# EAGLE schematic HeaterCotrolPlusPIC (EAGLE 7.5.0)
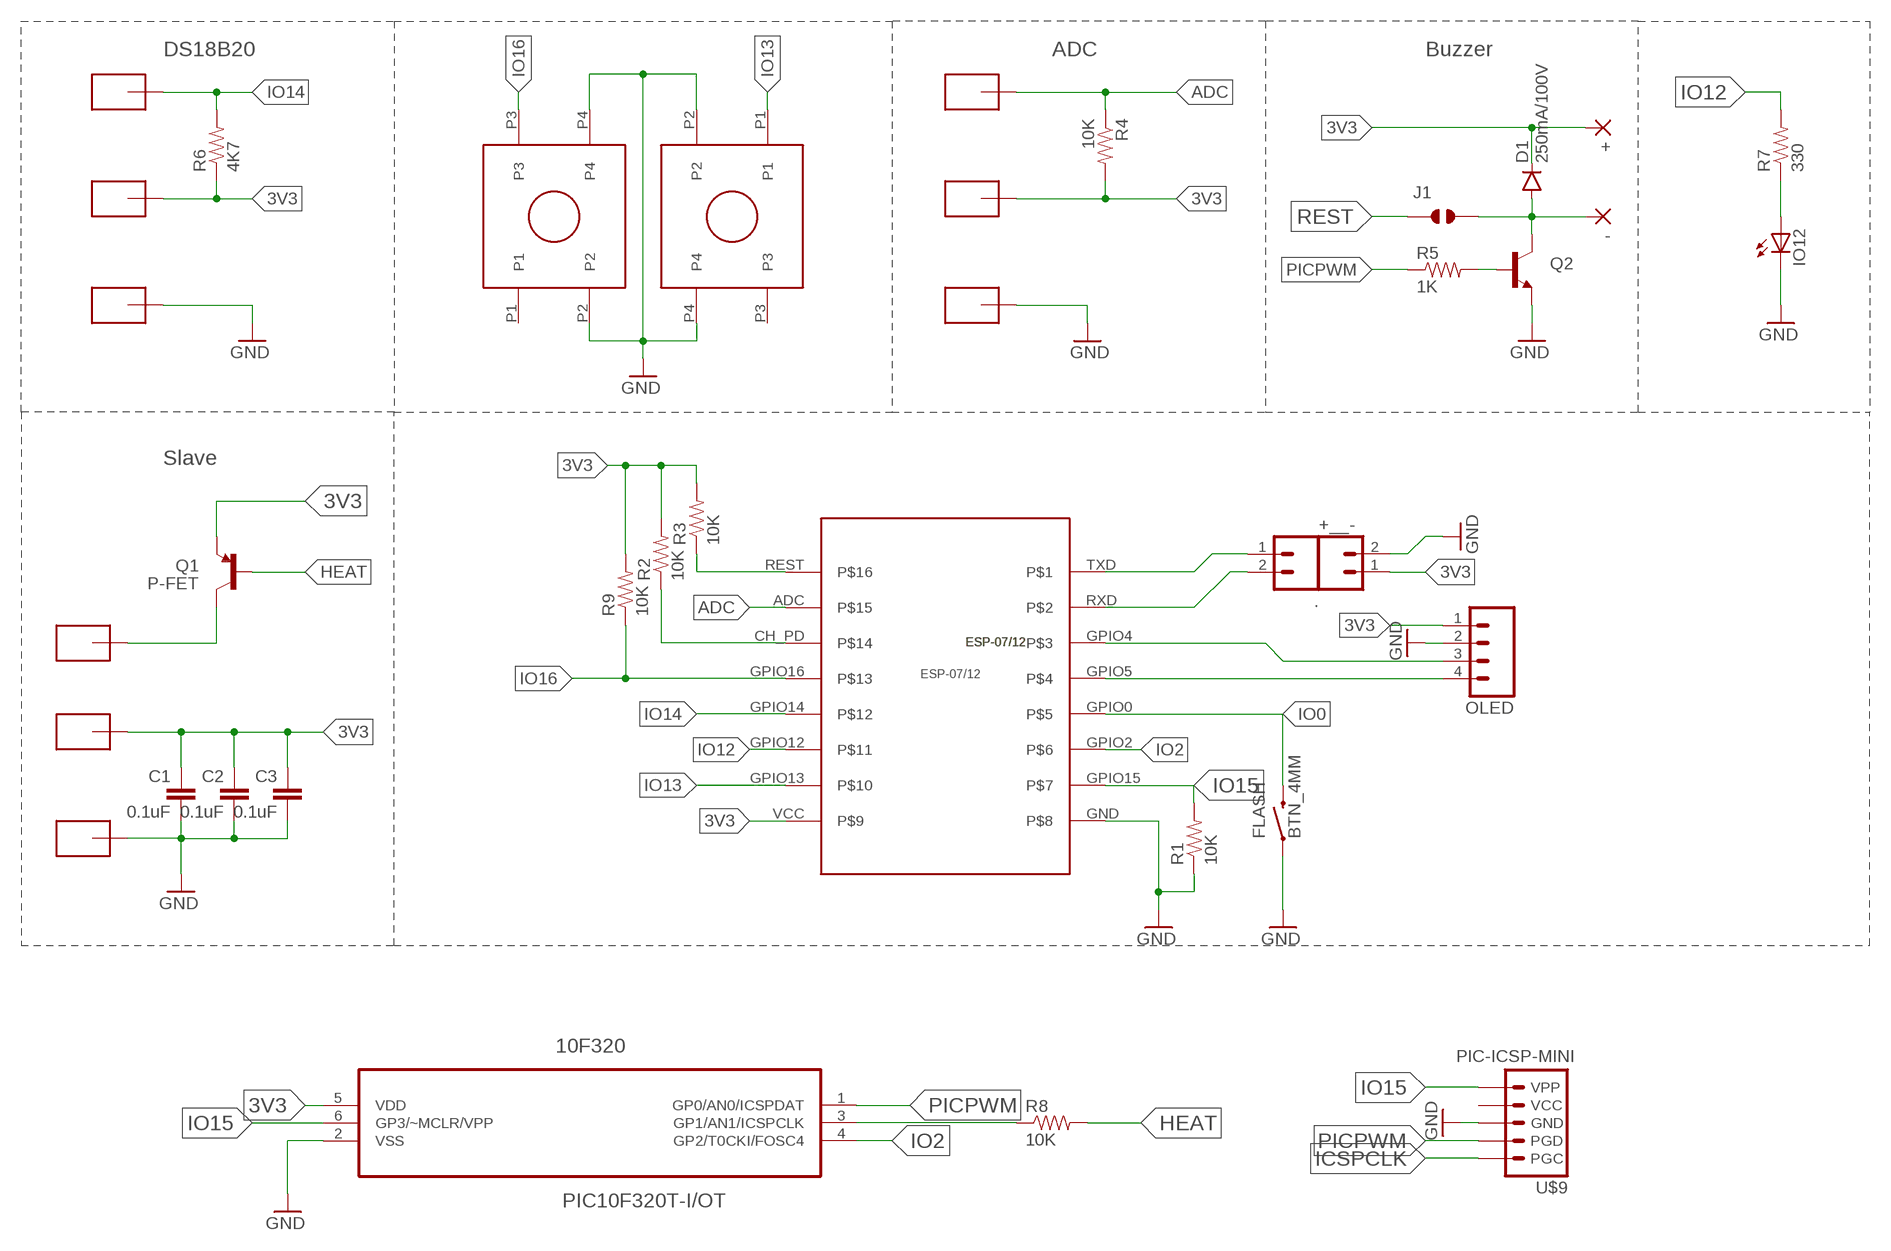
[diagram p0: schematic, sheet 1]

## Parts
10F320  PIC10F320T-I/OT  PIC10F220T-I/OT  [SOT95P270X145-6N]
+  1,6/0,8  [1,6/0,8]
+__-  M02PTH  [1X02]
-  1,6/0,8  [1,6/0,8]
.  M02PTH  [1X02]
C1  0.1uF  CAP  [0805-CAP]
C2  0.1uF  CAP  [0805-CAP]
C3  0.1uF  CAP  [0805-CAP]
D1  250mA/100V  DIODEBAS16  [SOD-323]
FLASH  BTN_4MM  [BTN_4MM]
IO12  LEDCHIP-LED0805  [CHIP-LED0805]
J1  JUMPER_SOLDER_1X2  [JUMPER_SOLDER_1X2]
LEFT  OMROM_TH  [OMROM_TH]
OLED  M04PTH  [1X04]
Q1  P-FET  TRANSISTOR_PNPSMD  [SOT23-3]
Q2  TRANSISTOR_NPNSOT23-3  [SOT23-3]
R1  10K  RESISTOR0805-RES  [0805]
R2  10K  RESISTOR0805-RES  [0805]
R3  10K  RESISTOR0805-RES  [0805]
R4  10K  RESISTOR0805-RES  [0805]
R5  1K  RESISTOR0805-RES  [0805]
R6  4K7  RESISTOR0805-RES  [0805]
R7  330  RESISTOR0805-RES  [0805]
R8  10K  RESISTOR0805-RES  [0805]
R9  10K  RESISTOR0805-RES  [0805]
RIGHT  OMROM_TH  [OMROM_TH]
U$1  ESP-07/12  [ESP-07/12]
U$2  SMD-PAD1  [SMD-PAD1]
U$3  SMD-PAD1  [SMD-PAD1]
U$4  SMD-PAD1  [SMD-PAD1]
U$5  SMD-PAD1  [SMD-PAD1]
U$6  SMD-PAD1  [SMD-PAD1]
U$7  SMD-PAD1  [SMD-PAD1]
U$8  SMD-PAD1  [SMD-PAD1]
U$9  PIC-ICSP-MINI  [PIC-ICSP-MINI]
U$10  SMD-PAD1  [SMD-PAD1]
U$11  SMD-PAD1  [SMD-PAD1]

## Nets
3V3: 10F320.5(VDD) +.1(P) +__-.1 C1.1 C2.1 C3.1 D1.C OLED.1 Q1.2(E) R2.2 R3.2 R4.2 R6.1 R9.2 U$1.VCC U$3.>NAME U$4.>NAME U$8.>NAME
ADC: R4.1 U$1.ADC U$7.>NAME
GND: 10F320.2(VSS) +__-.2 C1.2 C2.2 C3.2 FLASH.1 IO12.C LEFT.P2 LEFT.P4 OLED.2 Q2.2(E) R1.1 RIGHT.P2 RIGHT.P4 U$1.GND U$5.>NAME U$6.>NAME U$9.3(GND) U$11.>NAME
HEAT: Q1.1(B) R8.2
ICSPCLK: 10F320.3(GP1/AN1/ICSPCLK) R8.1 U$9.5(PGC)
IO0: FLASH.2 U$1.GPIO0
IO2: 10F320.4(GP2/T0CKI/FOSC4) U$1.GPIO2
IO12: R7.2 U$1.GPIO12
IO13: RIGHT.P1 U$1.GPIO13
IO14: R6.2 U$1.GPIO14 U$10.>NAME
IO15: 10F320.6(GP3/~MCLR/VPP) R1.2 U$1.GPIO15 U$9.1(VPP)
IO16: LEFT.P3 R9.1 U$1.GPIO16
N$1: Q1.3(C) U$2.>NAME
N$2: Q2.1(B) R5.2
N$3: OLED.3 U$1.GPIO4
N$4: -.1(P) D1.A J1.2 Q2.3(C)
N$5: IO12.A R7.1
N$9: OLED.4 U$1.GPIO5
N$11: R2.1 U$1.CH_PD
PICPWM: 10F320.1(GP0/AN0/ICSPDAT) R5.1 U$9.4(PGD)
REST: J1.1 R3.1 U$1.REST
RXD: ..2 U$1.RXD
TXD: ..1 U$1.TXD
Unconnected: LEFT.P1 RIGHT.P3 U$9.2(VCC)

## Notes on the sheet
- DS18B20 | ADC | Buzzer
- Slave

## Library data of the parts
10F320 = Microchip_By_element14_Batch_1:PIC10F220T-I/OT: High-Performance Microcontroller with 8-bit A/D; MPN: PIC10F220T-I/OT; OC_FARNELL: 1332175; OC_NEWARK: 31K4981; PACKAGE: SOT-6; SUPPLIER: Microchip
+ - = wirepad:1,6/0,8: THROUGH-HOLE PAD
+__- . = SparkFun-Connectors:M02: Standard 2-pin 0.1" header. Use with - straight break away headers ( PRT-00116) - right angle break away headers (PRT-00553) - swiss pins (PRT-00743) - machine pins (PRT-00117) - female headers (PRT-00115) Molex polarized connector foot print use with: PRT-08233 with associated crimp pins and housings. 2.54_SCREWTERM for use with PRT-10571. 3.5mm Screw Terminal footprints for PRT-08084 5mm Screw Terminal footprints for use with PRT-08432
C1-C3 = SparkFun-Capacitors:CAP: Capacitor Standard 0603 ceramic capacitor, and 0.1" leaded capacitor.
D1 = SparkFun-DiscreteSemi:DIODE: Diode These are standard reverse protection diodes and small signal diodes. SMA package can handle up to about 1A. SOD-323 can handle about 200mA. What the SOD-323 package when ordering, there are some mfgs out there that are 5-pin packages.; PROD_ID: DIO-09646
FLASH = CuriousTech:BTN_4MM
IO12 = led:LED: LED OSRAM: - CHIPLED LG R971, LG N971, LY N971, LG Q971, LY Q971, LO R971, LY R971 LH N974, LH R974 LS Q976, LO Q976, LY Q976 LO Q996 - Hyper CHIPLED LW Q18S LB Q993, LB Q99A, LB R99A - SideLED LS A670, LO A670, LY A670, LG A670, LP A670 LB A673, LV A673, LT A673, LW A673 LH A674 LY A675 LS A676, LA A676, LO A676, LY A676, LW A676 LS A679, LY A679, LG A679 - Hyper Micro SIDELEDÂ® LS Y876, LA Y876, LO Y876, LY Y876 LT Y87S - SmartLED LW L88C, LW L88S LB L89C, LB L89S, LG L890 LS L89K, LO L89K, LY L89K LS L896, LA L896, LO L896, LY L896 - TOPLED LS T670, LO T670, LY T670, LG T670, LP T670 LSG T670, LSP T670, LSY T670, LOP T670, LYG T670 LG T671, LOG T671, LSG T671 LB T673, LV T673, LT T673, LW T673 LH T674 LS T676, LA T676, LO T676, LY T676, LB T676, LH T676, LSB T676, LW T676 LB T67C, LV T67C, LT T67C, LS T67K, LO T67K, LY T67K, LW E67C LS E67B, LA E67B, LO E67B, LY E67B, LB E67C, LV E67C, LT E67C LW T67C LS T679, LY T679, LG T679 LS T770, LO T770, LY T770, LG T770, LP T770 LB T773, LV T773, LT T773, LW T773 LH T774 LS E675, LA E675, LY E675, LS T675 LS T776, LA T776, LO T776, LY T776, LB T776 LHGB T686 LT T68C, LB T68C - Hyper Mini TOPLEDÂ® LB M676 - Mini TOPLED SantanaÂ® LG M470 LS M47K, LO M47K, LY M47K Source: http://www.osram.convergy.de LUXEON: - LUMILEDÂ® LXK2-PW12-R00, LXK2-PW12-S00, LXK2-PW14-U00, LXK2-PW14-V00 LXK2-PM12-R00, LXK2-PM12-S00, LXK2-PM14-U00 LXK2-PE12-Q00, LXK2-PE12-R00, LXK2-PE12-S00, LXK2-PE14-T00, LXK2-PE14-U00 LXK2-PB12-K00, LXK2-PB12-L00, LXK2-PB12-M00, LXK2-PB14-N00, LXK2-PB14-P00, LXK2-PB14-Q00 LXK2-PR12-L00, LXK2-PR12-M00, LXK2-PR14-Q00, LXK2-PR14-R00 LXK2-PD12-Q00, LXK2-PD12-R00, LXK2-PD12-S00 LXK2-PH12-R00, LXK2-PH12-S00 LXK2-PL12-P00, LXK2-PL12-Q00, LXK2-PL12-R00 Source: www.luxeon.com KINGBRIGHT: KA-3528ASYC Source: www.kingbright.com
J1 = dp_devices:JUMPER_SOLDER_1X2
LEFT RIGHT = CuriousTech:OMROM_TH: C&K KSA0M211 LFT + cap BTNK0120 (untested)
OLED = SparkFun-Connectors:M04: Header 4 Standard 4-pin 0.1" header. Use with straight break away headers (SKU : PRT-00116), right angle break away headers (PRT-00553), swiss pins (PRT-00743), machine pins (PRT-00117), and female headers (PRT-00115). Molex polarized connector foot print use with SKU : PRT-08231 with associated crimp pins and housings. 1MM SMD Version SKU: PRT-10208
Q1 = SparkFun-DiscreteSemi:TRANSISTOR_PNP: Generic PNP BJT Double check pinouts against datasheets- not all devices are the same! MMBT3906 - 40V 200mA SOT-23 (TRANS-08052) MMBT4403 - 40V 600mA SOT-23 (TRANS-09245)
Q2 = SparkFun-DiscreteSemi:TRANSISTOR_NPN: Generic NPN BJT MMBT2222A - TRANS-08049 (SOT-23, 1A 40V) MPSA42 - TRANS-09116 (SOT-23, 500mA 300V) MMBT5088LT1G - TRANS-11160 (SOT-23, 50 mA 30V) BC547 - COM-08928 <http://www.sparkfun.com/products/8928> (TO-92 45V 100mA) (1.Collector 2.Base 3.Emitter) 2N3904 - COM-00521 <http://www.sparkfun.com/products/521> (TO-92 40V 200mA) (1.Emitter 2.Base 3.Collector) P2N2222A - COM-12852 <http://www.sparkfun.com/products/12852> (TO-92 40V 600mA) (1.Collector 2.Base 3.Emitter); PROD_ID: TRANS-08049
R1-R9 = SparkFun-Resistors:RESISTOR: Resistor Basic schematic elements and footprints for 0603, 1206, and PTH resistors.
U$1 = ESP-07_12:ESP-07/12: Version 1.0 of the library for the ESP-07/12 full GPIO dev board module byME Jon jonnyradu@gmail.com
U$2-U$8 U$10 U$11 = CuriousTech:SMD-PAD1: SMD-PAD small
U$9 = SparkFun-Connectors:PIC-ICSP-MINI: PIC-ICSP-Mini Miniature 5-pin connection for temporary programming of PICs. Use this device in your design to save space. Program the PIC with this adapter Spark Fun Electronics SKU : BOB-00194